# EAGLE design McPiFace-MiniOled-V1 (EAGLE 7.4.0)
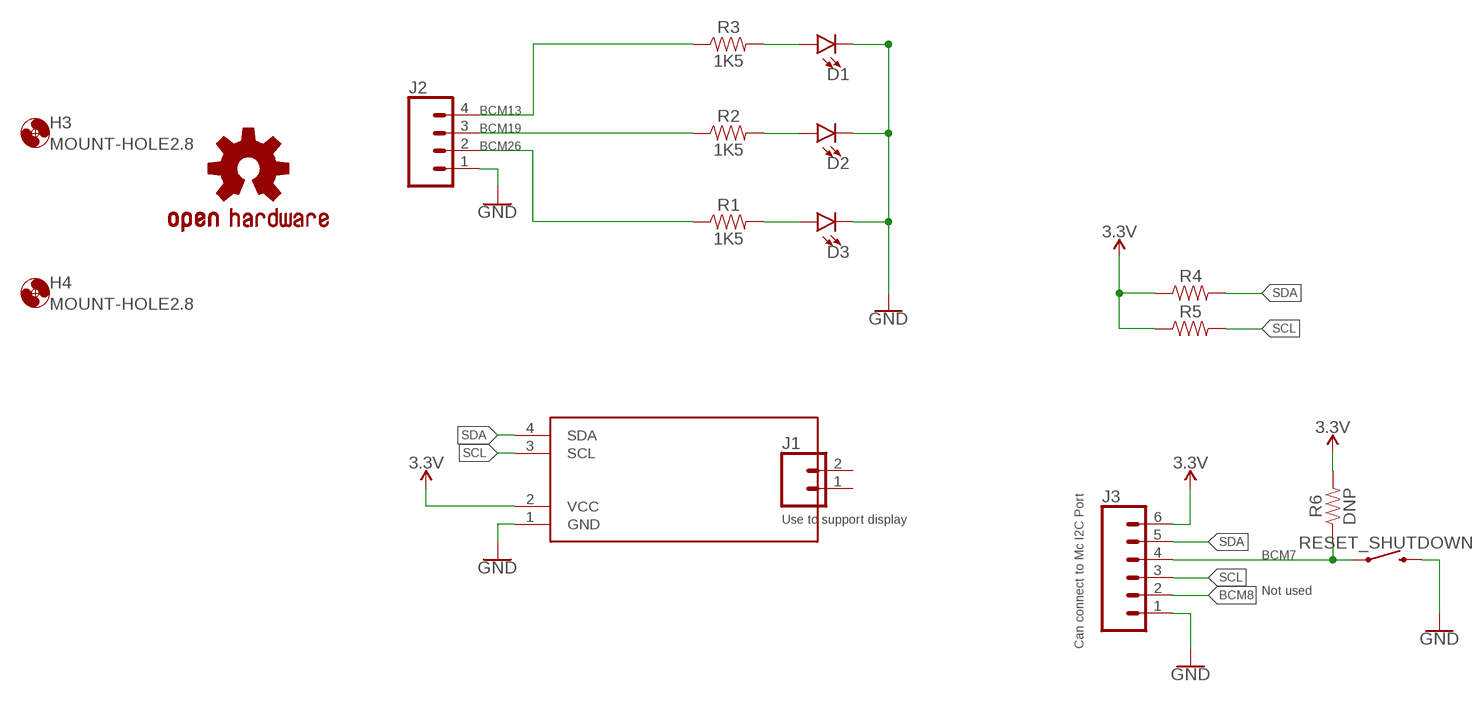
[diagram p0: schematic, sheet 1]

## Parts
D1  LED1206-BOTTOM-1.6MM  [LED-1206-BOTTOM-1.6MM]
D2  LED1206-BOTTOM-1.6MM  [LED-1206-BOTTOM-1.6MM]
D3  LED1206-BOTTOM-1.6MM  [LED-1206-BOTTOM-1.6MM]
DISPLAY  DISPLAY0.91_INCH_DISPLAY  [I2C_DISPLAY_0.91_INCH]
H3  MOUNT-HOLE2.8  [2,8]
H4  MOUNT-HOLE2.8  [2,8]
J1  CONN_021X02_NO_SILK  [1X02_NO_SILK]
J2  CONN_04SMD2  [1X04_1MM_RA]
J3  CONN_06SMD-1MM  [1X06-1MM]
LOGO1  OSHW-LOGOL  [OSHW-LOGO-L]
R1  1K5  RESISTOR0805  [0805]
R2  1K5  RESISTOR0805  [0805]
R3  1K5  RESISTOR0805  [0805]
R4  RESISTOR0805  [0805]
R5  RESISTOR0805  [0805]
R6  DNP  RESISTOR0805  [0805]
RESET_SHUTDOWN  Reset/Powerdown  MOMENTARY-SWITCH-SPSTTACKTILE_SWITCH_PTH_6.0MM_NO_TOP_RESIST  [TACTILE_SWITCH_PTH_6.0MM_NO_TOP_RESIST]

## Nets
3.3V: DISPLAY.2(VCC) J3.6 R4.1 R5.1 R6.2
BCM7: J3.4 R6.1 RESET_SHUTDOWN.1
BCM8: J3.2
BCM13: J2.4 R3.1
BCM19: J2.3 R2.1
BCM26: J2.2 R1.1
GND: D1.C D2.C D3.C DISPLAY.1(GND) J2.1 J3.1 RESET_SHUTDOWN.3
N$1: D3.A R1.2
N$2: D1.A R3.2
N$3: D2.A R2.2
SCL: DISPLAY.3(SCL) J3.3 R5.2
SDA: DISPLAY.4(SDA) J3.5 R4.2
Unconnected: J1.1 J1.2

## Notes on the sheet
- Use to support display
- Not used
- Can connect to Mc I2C Port

## Library data of the parts
D1-D3 = ThingySticks:LED: LED (Generic) Standard schematic elements and footprints for 5mm, 3mm, 1206, and 0603 sized LEDs. Generic LEDs with no color specified.
DISPLAY = ThingySticks:DISPLAY
H3 H4 = holes:MOUNT-HOLE: MOUNTING HOLE with drill center marker
J1 = SparkFun-Connectors:CONN_02: Multi connection point. Often used as Generic Header-pin footprint for 0.1 inch spaced/style header connections On any of the 0.1 inch spaced packages, you can populate with these: Break Away Headers - Straight <https://www.sparkfun.com/products/116> (PRT-00116) Break Away Male Headers - Right Angle <https://www.sparkfun.com/products/553> (PRT-00553) Female Headers <https://www.sparkfun.com/products/115> (PRT-00115) Break Away Headers - Machine Pin <https://www.sparkfun.com/products/117> (PRT-00117) Break Away Female Headers - Swiss Machine Pin <https://www.sparkfun.com/products/743> (PRT-00743) For SCREWTERMINALS and SPRING TERMINALS visit here: Screw Terimnals on SparkFun.com <https://www.sparkfun.com/search/results?term=Screw+Terminals> (5mm/3.5mm/2.54mm spacing) This device is also useful as a general connection point to wire up your design to another part of your project. Our various solder wires solder well into these plated through hole pads. Hook-Up Wire - Assortment (Stranded, 22 AWG) <https://www.sparkfun.com/products/11375> (PRT-11375) Hook-Up Wire - Assortment (Solid Core, 22 AWG) <https://www.sparkfun.com/products/11367> (PRT-11367) View the entire wire category on our website here <https://www.sparkfun.com/categories/141> Special notes: Molex polarized connector foot print use with: PRT-08233 with associated crimp pins and housings. 2.54_SCREWTERM for use with PRT-10571. 3.5mm Screw Terminal footprints for PRT-08084 5mm Screw Terminal footprints for use with PRT-08432
J2 = SparkFun-Connectors:CONN_04: Multi connection point. Often used as Generic Header-pin footprint for 0.1 inch spaced/style header connections On any of the 0.1 inch spaced packages, you can populate with these: Break Away Headers - Straight <https://www.sparkfun.com/products/116> (PRT-00116) Break Away Male Headers - Right Angle <https://www.sparkfun.com/products/553> (PRT-00553) Female Headers <https://www.sparkfun.com/products/115> (PRT-00115) Break Away Headers - Machine Pin <https://www.sparkfun.com/products/117> (PRT-00117) Break Away Female Headers - Swiss Machine Pin <https://www.sparkfun.com/products/743> (PRT-00743) For SCREWTERMINALS and SPRING TERMINALS visit here: Screw Terimnals on SparkFun.com <https://www.sparkfun.com/search/results?term=Screw+Terminals> (5mm/3.5mm/2.54mm spacing) This device is also useful as a general connection point to wire up your design to another part of your project. Our various solder wires solder well into these plated through hole pads. Hook-Up Wire - Assortment (Stranded, 22 AWG) <https://www.sparkfun.com/products/11375> (PRT-11375) Hook-Up Wire - Assortment (Solid Core, 22 AWG) <https://www.sparkfun.com/products/11367> (PRT-11367) View the entire wire category on our website here <https://www.sparkfun.com/categories/141> Special notes: Molex polarized connector foot print use with SKU : PRT-08231 with associated crimp pins and housings. 1MM SMD Version SKU: PRT-10208; PROD_ID: CONN-10310; SF_ID: PRT-10208
J3 = SparkFun-Connectors:CONN_06: Multi connection point. Often used as Generic Header-pin footprint for 0.1 inch spaced/style header connections On any of the 0.1 inch spaced packages, you can populate with these: Break Away Headers - Straight <https://www.sparkfun.com/products/116> (PRT-00116) Break Away Male Headers - Right Angle <https://www.sparkfun.com/products/553> (PRT-00553) Female Headers <https://www.sparkfun.com/products/115> (PRT-00115) Break Away Headers - Machine Pin <https://www.sparkfun.com/products/117> (PRT-00117) Break Away Female Headers - Swiss Machine Pin <https://www.sparkfun.com/products/743> (PRT-00743) Arduino Stackable Header - 6 Pin <https://www.sparkfun.com/products/9280> (PRT-09280) For SCREWTERMINALS and SPRING TERMINALS visit here: Screw Terimnals on SparkFun.com <https://www.sparkfun.com/search/results?term=Screw+Terminals> (5mm/3.5mm/2.54mm spacing) This device is also useful as a general connection point to wire up your design to another part of your project. Our various solder wires solder well into these plated through hole pads. Hook-Up Wire - Assortment (Stranded, 22 AWG) <https://www.sparkfun.com/products/11375> (PRT-11375) Hook-Up Wire - Assortment (Solid Core, 22 AWG) <https://www.sparkfun.com/products/11367> (PRT-11367) View the entire wire category on our website here <https://www.sparkfun.com/categories/141>; PROD_ID: CONN-08249; SF_ID: GPS-00579
LOGO1 = SparkFun-Aesthetics:OSHW-LOGO: Open-Source Hardware (OSHW) Logo This logo indicates the piece of hardware it is found on incorporates a OSHW license and/or adheres to the definition of open source hardware found here: http://freedomdefined.org/OSHW
R1-R6 = SparkFun-Resistors:RESISTOR: Generic Resistor Package
RESET_SHUTDOWN = ThingySticks:MOMENTARY-SWITCH-SPST: Momentary Switch (Pushbutton) - SPST Normally-open (NO) SPST momentary switches (buttons, pushbuttons). Variants PTH-12MM - 12mm square, through-hole Momentary Pushbutton Switch - 12mm Square <https://www.sparkfun.com/products/9190> (COM-09190) PTH-6.0MM, PTH-6.0MM-KIT - 6.0mm square, through-hole Mini Pushbutton Switch <https://www.sparkfun.com/products/97> (COM-00097) KIT package intended for soldering kit's - only one side of pads' copper is exposed. PTH-RIGHT-ANGLE-KIT - Right-angle, through-hole Right Angle Tactile Button <https://www.sparkfun.com/products/10791> - Used on SparkFun BigTime Watch Kit <https://www.sparkfun.com/products/11734> SMD-12MM - 12mm square, surface-mount Tactile Button - SMD (12mm) <https://www.sparkfun.com/products/12993> (COM-12993) Used on SparkFun PicoBoard <https://www.sparkfun.com/products/11888> SMD-4.5MM - 4.5mm Square Trackball Switch Used on SparkFun Blackberry Trackballer Breakout <https://www.sparkfun.com/products/13169> SMD-4.6MMX2.8MM - 4.60mm x 2.80mm, surface mount Used on SparkFun SAMD21 Mini Breakout <https://www.sparkfun.com/products/13664> SMD-5.2MM, SMD-5.2-REDUNDANT - 5.2mm square, surface-mount Mini Pushbutton Switch - SMD <https://www.sparkfun.com/products/8720> (COM-08720) Used on Arduino Pro Mini <https://www.sparkfun.com/products/11114> REDUNDANT package connects both switch circuits together SMD-6.0X3.5MM - 6.0 x 3.5mm, surface mount Momentary Reset Switch SMD <https://www.sparkfun.com/products/8229> (COM-08229) SMD-6.2MM-TALL - 6.2mm square, surface mount Tactile Button - SMD (6mm) <https://www.sparkfun.com/products/12992> Used on SparkFun Digital Sandbox <https://www.sparkfun.com/products/12651> SMD-RIGHT-ANGLE - Right-angle, surface mount Used on SparkFun Block for Intel® Edison - Arduino <https://www.sparkfun.com/products/13036>

## Board
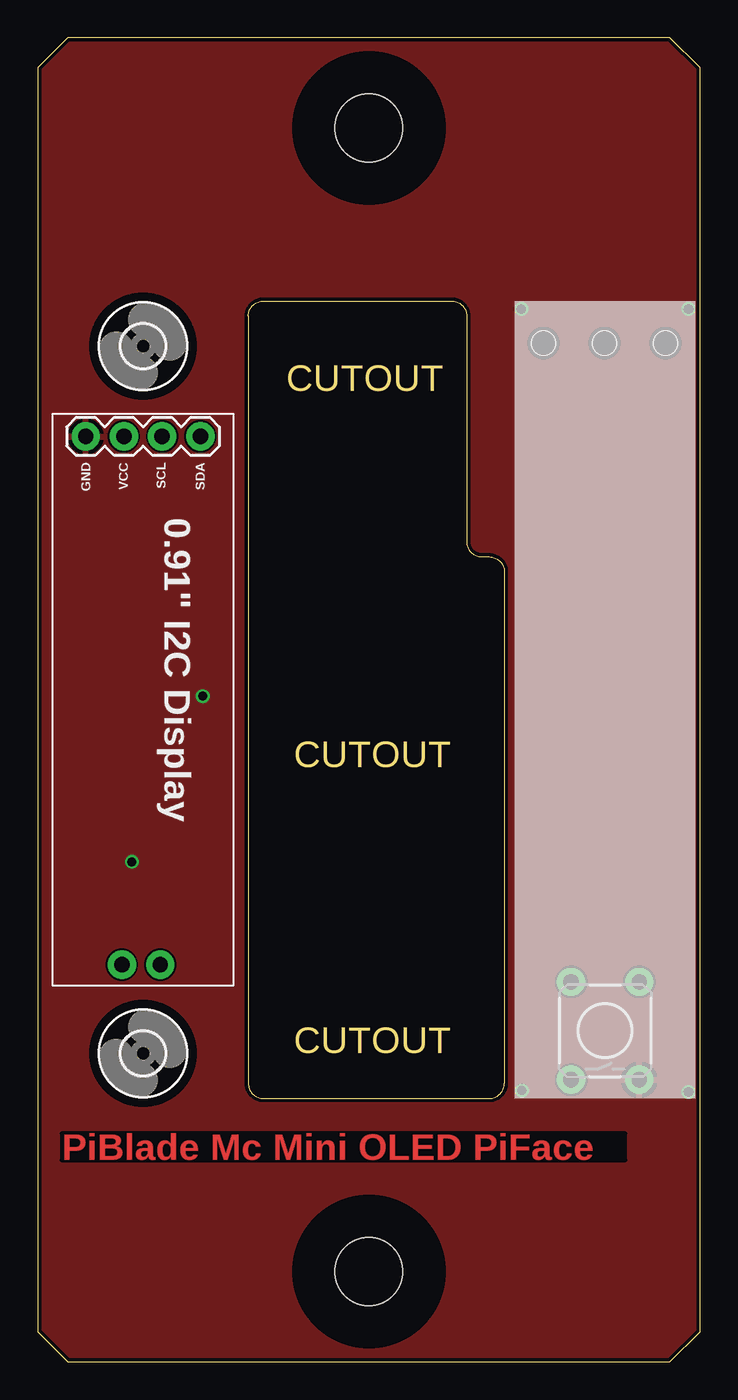
[diagram p1: board, top side]
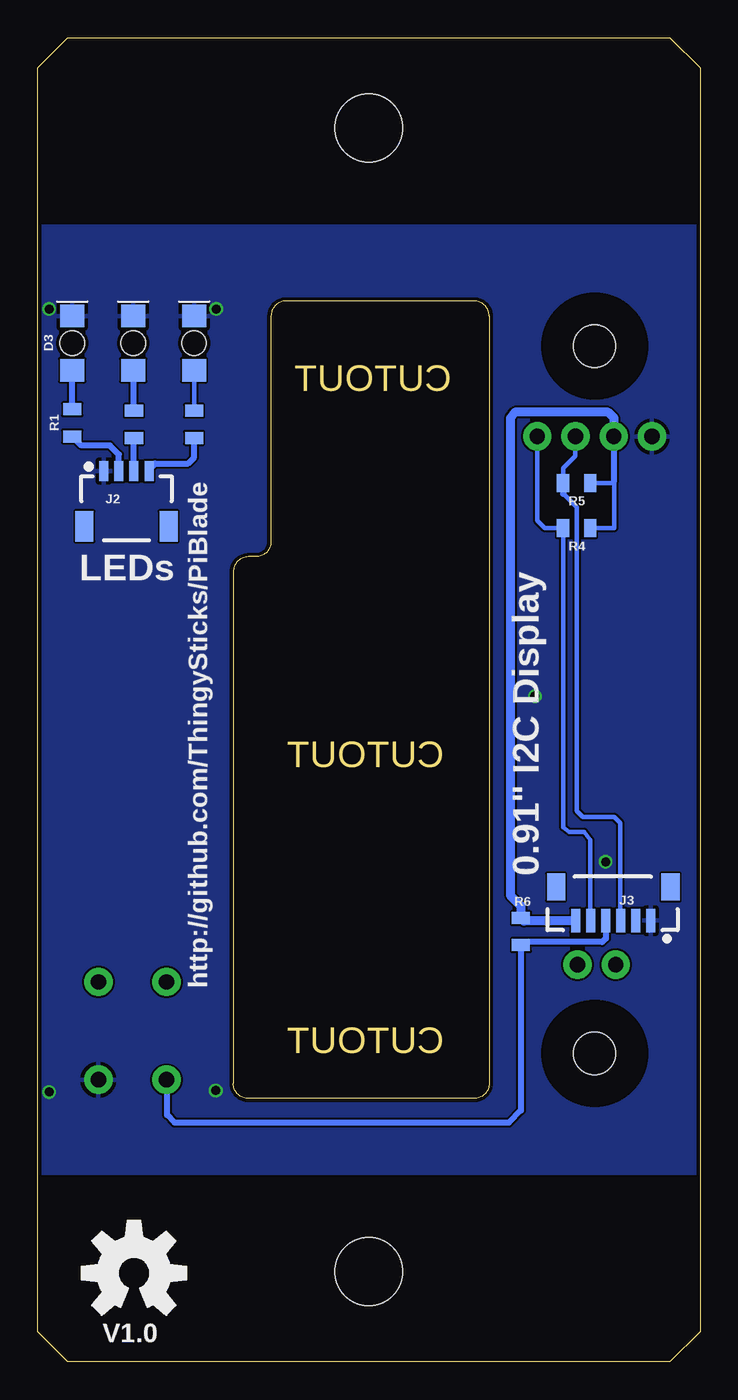
[diagram p2: board, bottom side, seen from below]

Size 44 x 88 mm. Coordinates in mm from the lower left corner, seen from the top.
Outline: 2,0 42,0 44,2 44,86 42,88 2,88 0,86 0,2 2,0
Outline: 14,69.5 14,18.5 arc90 15,17.5 30,17.5 arc90 31,18.5 31,52.5 arc90 30,53.5 29.5,53.5 arc-90 28.5,54.5 28.5,69.5 arc90 27.5,70.5 15,70.5 arc90 14,69.5
Copper layers (1*16): Top 0.035mm / dielectric 1.5mm / Bottom 0.035mm
Design rules "dirt_cheap_dirty_boards.v1": minimum track width 5mil, minimum drill 12mil, track to track 5mil, track to pad 5mil, pad to pad 5mil, via to via 5mil, smd to smd 0mil, copper to edge 10mil, drill to drill 10mil, minimum pad ring 10mil, minimum via ring 6mil, stop-mask expansion 2mil, vias tented up to drill 25mil, thermal gap 10mil
Holes 4.5 mm at 22,6 22,82
tRestrict: area 17,77 to 27,87; area 17,1 to 27,11
bRestrict: area -0.5,-0.4 to 44.6,12.4; area -0.2,75.6 to 44.4,88.2

### Footprints (pad centres in the part's own frame; a part is rotated, then mirrored left to right if it is on the bottom)
LED-1206-BOTTOM-1.6MM = smd 1.5 x 1.6: A -1.8,0; C 1.8,0 | hole 1.6: 0,0
I2C_DISPLAY_0.91_INCH = drill 1.016 pad 1.88: 1 1.5,2.19; 2 1.5,4.73; 3 1.5,7.27; 4 1.5,9.81
2,8 = hole 2.8: 0,0
1X02_NO_SILK = drill 1.016 pad 1.88: 1 0,0; 2 2.54,0
1X04_1MM_RA = smd 0.6 x 1.35: 1 -1.5,0; 2 -0.5,0; 3 0.5,0; 4 1.5,0 | smd 1.2 x 2: NC1 2.8,-3.675; NC2 -2.8,-3.675
1X06-1MM = smd 0.6 x 1.55: 1 -2.54,1.27; 2 -1.54,1.27; 3 -0.54,1.27; 4 0.46,1.27; 5 1.46,1.27; 6 2.46,1.27 | smd 1.2 x 1.8: P$1 -3.84,-0.955; P$2 3.76,-0.955
0805 = smd 0.8 x 1.2: 1 -0.9,0; 2 0.9,0
TACTILE_SWITCH_PTH_6.0MM_NO_TOP_RESIST = drill 1.016 pad 1.88: 1 -3.251,2.261; 2 3.251,2.261; 3 -3.251,-2.261; 4 3.251,-2.261

### Placement (x,y rotation side)
D1  33.6,67.7 90 bottom
D2  37.65,67.7 90 bottom
D3  41.7,67.7 90 bottom
DISPLAY  1,63 270 top
H3  7,20.5 0 top
H4  7,67.5 0 top
J1  5.6,26.4 0 top
J2  38.1,59.2 0 bottom
J3  5.8,30.6 180 bottom
LOGO1  37.6,5.9 0 bottom
R1  41.7,62.4 90 bottom
R2  37.6,62.3 90 bottom
R3  33.6,62.3 90 bottom
R4  8.2,55.4 180 bottom
R5  8.2,58.4 180 bottom
R6  11.9,28.6 90 bottom
RESET_SHUTDOWN  37.7,22 90 top

### Tracks (layer width: path | path; a pad name or v marks a point on that pad's centre or on a via)
3.3V
  Bottom 0.305: R5.1 5.8,58.4 5.7,58.5 5.7,55.4 R4.1
  Bottom 0.406: 8.3,29.29 J3.6 | 5.7,58.5 5.7,61.47
  Bottom 0.61: 8.3,29.29 11.69,29.29 R6.2 11.9,30.3 12.6,31 12.6,62.7 12.3,63.1 6.1,63.1 5.7,62.7 5.7,61.47
  Bottom 0.813: 5.7,61.47 DISPLAY.2
BCM7
  Bottom 0.406: R6.1 11.9,27.6 | 11.9,27.6 11.9,16.7 12.7,15.9 34.9,15.9 35.4,16.4 35.4,18.71 RESET_SHUTDOWN.1 | J3.4 6.26,28.14 6.5,27.9 11.7,27.9 11.9,27.6
BCM13
  Bottom 0.406: J2.4 36.6,59.3 36.2,59.7 34,59.7 33.6,60.1 R3.1
BCM19
  Bottom 0.406: J2.3 R2.1
BCM26
  Bottom 0.406: J2.2 38.6,60.3 39.2,60.9 41.1,60.9 R1.1
GND  (via drill 0.6, 0.6 pad 0.25)
  other vias: 43.23,69.97 43.23,17.93 32.16,18.04 10.96,44.23 32.13,69.97 6.26,33.23
  pour Top: -1,88.5 45,88.5 45,-1 -1,-1
  pour Bottom: -1,88.5 45,88.5 45,-1 -1,-1
N$1
  Bottom 0.406: R1.2 D3.A
N$2
  Bottom 0.305: R3.2 D1.A
N$3
  Bottom 0.406: R2.2 37.6,65.55 D2.A
SCL
  Bottom 0.305: R5.2 9.1,59.4 8.3,60.2 8.3,61.47 | 9.1,57.7 8.2,56.8 8.2,36.6 7.8,36.2 5.7,36.2 5.3,35.8 5.3,29.37
  Bottom 0.406: 5.3,29.67 J3.3 5.3,29.37 | 8.3,61.47 DISPLAY.3 | R5.2 9.1,57.7
SDA
  Bottom 0.254: DISPLAY.4
  Bottom 0.305: DISPLAY.4 10.8,55.9 10.3,55.4 R4.2 9.1,35.5 8.7,35.2 7.7,35.2 7.3,34.7 7.3,29.37
  Bottom 0.406: DISPLAY.4 | 7.3,29.37 J3.5

### Text on the board
Top: PiBlade Mc Mini OLED PiFace
Dimension: CUTOUT | CUTOUT | CUTOUT
tNames: 0.91" I2C Display
bNames: http://github.com/ThingySticks/PiBlade | LEDs | 0.91" I2C Display | V1.0